# Altium schematic sheet Power.SchDoc: =DocumentName
size A4; Organization: Queen's Formula SAE; Address1: 130 Stuart St, Kingston; Address2: Ontario; Address3: Canada; Address4: K7L 2V9; DocumentNumber: 1; Revision: 0; SheetNumber: 1; SheetTotal: 1
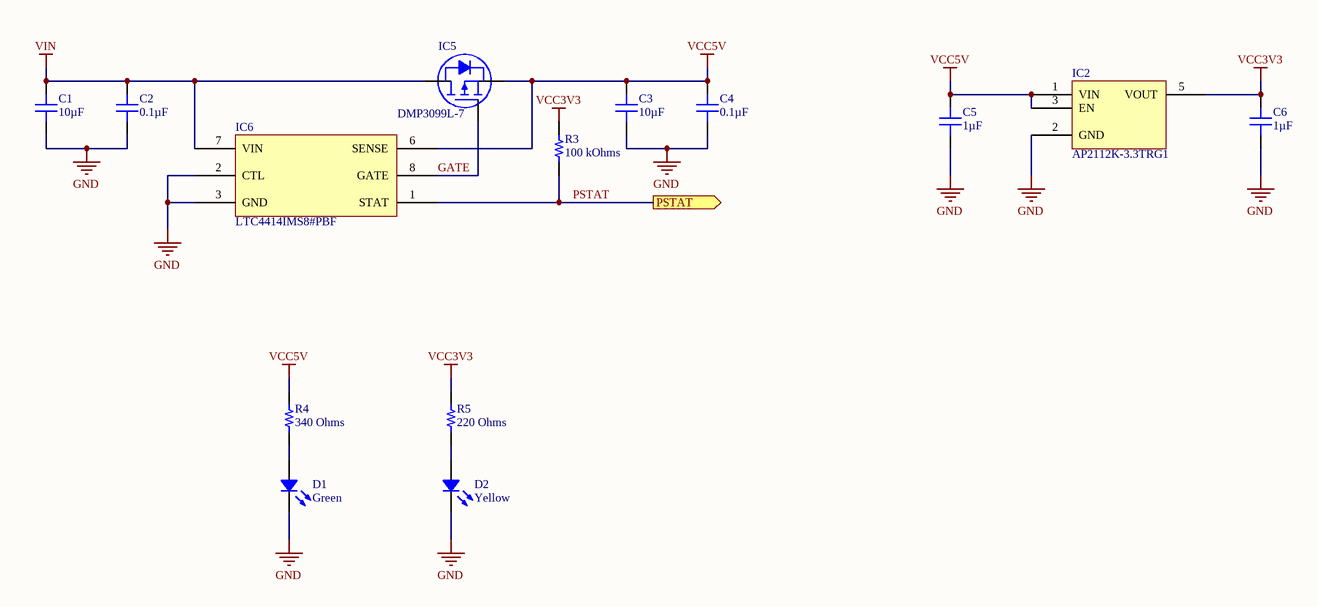
[diagram p0: Power.SchDoc]

## Parts
C1  10µF  [CAP 0402_1005]
C2  0.1µF  [CAP 0402_1005]
C3  10µF  [CAP 0402_1005]
C4  0.1µF  [CAP 0402_1005]
C5  1µF  [CAP 0402_1005]
C6  1µF  [CAP 0402_1005]
D1  Green  [LED 0402_1005 GREEN]
D2  Yellow  [LED 0402_1005 YELLOW]
IC2  AP2112K-3.3TRG1  [DIODES SOT-23-5 W5]
IC5  DMP3099L-7  [DIODES SOT-23-3]
IC6  LTC4414IMS8#PBF  [ANALOG MSOP-8 RM-8]
R3  100 kOhms  [RES 0201_0603]
R4  340 Ohms  [RES 0402_1005]
R5  220 Ohms  [RES 0402_1005]

## Ports
PSTAT (out)

## Nets
GND: C1.1 C2.1 C3.1 C4.1 C5.1 C6.1 D1.2 D2.2 IC2.2(GND) IC6.2(CTL) IC6.3(GND)
VCC3V3: C6.2 IC2.5(VOUT) R3.2 R5.2
VCC5V: C3.2 C4.2 C5.2 IC2.1(VIN) IC2.3(EN) IC5.2(S) IC6.6(SENSE) R4.2
VIN: C1.2 C2.2 IC5.3(D) IC6.7(VIN)
GATE: IC5.1(G) IC6.8(GATE)
PSTAT: IC6.1(STAT) R3.1 ; port PSTAT
NetD1_1: D1.1 R4.1
NetD2_1: D2.1 R5.1

## Notes on the sheet
- Title
- Size:
- Date:
- A4
- Number:
- Time:
- Revision:
- Sheet
- of
- File:

## Library data of the parts
C1 C3 = CL05A106MP8NUB8: CAP CER 10UF 10V X5R 0402; Manufacturer: Samsung Electro-Mechanics; Tolerance: ±20%; Part Number: CL05A106MP8NUB8; Value: 10µF; Applications: General Purpose; Capacitance: 10µF; ComponentLink1Description: Datasheet; ComponentLink1URL: http://www.samsungsem.com/kr/support/product-search/mlcc/CL05A106MP8NUB8.jsp; ComponentLink2Description: DigiKey Link; ComponentLink2URL: http://digikey.com/product-detail/en/samsung-electro-mechanics/CL05A106MP8NUB8/1276-6830-1-ND/5961689; Device Package: 0402 (1005 Metric); LastUpdated: 2020-09-02 1:02:25 AM; Lifecycle Status: Active; Minimum Order: 1; Mounting Type: Surface Mount, MLCC; Operating Temperature: -55°C ~ 85°C; Package / Case: 0402 (1005 Metric); Packaging: TapeAndReel; PartId: 1758; Part Status: Active; Price: 0.08; Series: CL; Size / Dimension: 0.039" L x 0.020" W (1.00mm x 0.50mm); Supplier 1: DigiKey; Supplier Part Number 1: 1276-6830-1-ND; Temperature Coefficient: X5R; Thickness (Max): 0.035" (0.90mm); Voltage - Rated: 10V
C2 C4 = C0402C104K4RECAUTO: CAP CER 0402 0.1UF 16V X7R 10%; Manufacturer: KEMET; Part Number: C0402C104K4RECAUTO; Value: 0.1µF; Applications: Automotive, ESD Protection; Capacitance: 0.1µF; ComponentLink1Description: Datasheet; ComponentLink1URL: https://api.kemet.com/component-edge/download/datasheet/C0402C104K4RECAUTO.pdf; ComponentLink2Description: DigiKey Link; ComponentLink2URL: http://digikey.com/product-detail/en/kemet/C0402C104K4RECAUTO/399-17167-1-ND/8563708; Device Package: 0402 (1005 Metric); LastUpdated: 2020-09-02 1:02:25 AM; Lifecycle Status: Active; Minimum Order: 1; Mounting Type: Surface Mount, MLCC; Operating Temperature: -55°C ~ 125°C; Package / Case: 0402 (1005 Metric); Packaging: TapeAndReel; PartId: 1731; Part Status: Active; Price: 0.02; Ratings: AEC-Q200; Series: ESD SMD Auto X7R; Size / Dimension: 0.039" L x 0.020" W (1.00mm x 0.50mm); Supplier 1: DigiKey; Supplier Part Number 1: 399-17167-1-ND; Temperature Coefficient: X7R; Thickness (Max): 0.022" (0.55mm); Tolerance: ±10%; Voltage - Rated: 16V
C5 C6 = 0402ZD105KAT4A: CAP CER 1UF 10V X5R 0402; Manufacturer: AVX Corporation; Tolerance: ±10%; Part Number: 0402ZD105KAT4A; Value: 1µF; Applications: General Purpose; Capacitance: 1µF; ComponentLink1Description: Datasheet; ComponentLink1URL: http://datasheets.avx.com/cx5r.pdf; ComponentLink2Description: DigiKey Link; ComponentLink2URL: http://digikey.com/product-detail/en/avx-corporation/0402ZD105KAT4A/478-10063-1-ND/6564285; Device Package: 0402 (1005 Metric); LastUpdated: 2020-09-02 1:02:25 AM; Lifecycle Status: Active; Minimum Order: 1; Mounting Type: Surface Mount, MLCC; Operating Temperature: -55°C ~ 85°C; Package / Case: 0402 (1005 Metric); Packaging: TapeAndReel; PartId: 1846; Part Status: Active; Price: 0.02; Series: -; Size / Dimension: 0.039" L x 0.020" W (1.00mm x 0.50mm); Supplier 1: DigiKey; Supplier Part Number 1: 478-10063-1-ND; Temperature Coefficient: X5R; Thickness (Max): 0.022" (0.56mm); Voltage - Rated: 10V
D1 = EAST10052GA0: LED GREEN CLEAR 2SMD; Manufacturer: Everlight Electronics Co Ltd; Configuration: Standard; Current - Test: 5mA; Lens Color: Colorless; Lens Size: 1.00mm x 0.50mm; Lens Style: Rectangle with Flat Top; Viewing Angle: 120°; Voltage - Forward (Vf) (Typ): 2.95V; Wavelength - Peak: 518nm; Part Number: EAST10052GA0; Color: Green; ComponentLink1Description: Datasheet; ComponentLink1URL: https://everlightamericas.com/index.php?controller=attachment&id_attachment=3256; ComponentLink2Description: DigiKey Link; ComponentLink2URL: http://digikey.com/product-detail/en/everlight-electronics-co-ltd/EAST10052GA0/1080-1557-1-ND/8510385; Device Package: 0402 (1005 Metric); Height (Max): 0.25mm; LastUpdated: 2020-09-02 1:20:38 AM; Lens Transparency: Clear; Lifecycle Status: Active; Minimum Order: 1; Mounting Type: Surface Mount; Package / Case: 0402 (1005 Metric); Packaging: TapeAndReel; PartId: 696; Part Status: Active; Price: 0.08; Series: -; Size / Dimension: 1.00mm L x 0.50mm W; Supplier 1: DigiKey; Supplier Part Number 1: 1080-1557-1-ND; Supplier Device Package: 2-SMD; Value: Green
D2 = APG1005SYC-T: LED YELLOW CLEAR CHIP SMD; Manufacturer: Kingbright; Configuration: Standard; Current - Test: 20mA; Lens Color: Colorless; Lens Size: 0.60mm x 0.50mm; Lens Style: Rectangle with Flat Top; Millicandela Rating: 100mcd; Viewing Angle: 120°; Voltage - Forward (Vf) (Typ): 2.05V; Wavelength - Dominant: 589nm; Wavelength - Peak: 591nm; Part Number: APG1005SYC-T; Color: Yellow; ComponentLink1Description: Datasheet; ComponentLink1URL: http://www.kingbrightusa.com/images/catalog/SPEC/APG1005SYC-T.pdf; ComponentLink2Description: DigiKey Link; ComponentLink2URL: http://digikey.com/product-detail/en/kingbright/APG1005SYC-T/754-1809-1-ND/4764945; Device Package: 0402 (1005 Metric); Height (Max): 0.25mm; LastUpdated: 2020-09-02 1:21:13 AM; Lens Transparency: Clear; Lifecycle Status: Active; Minimum Order: 1; Mounting Type: Surface Mount; Package / Case: 0402 (1005 Metric); Packaging: TapeAndReel; PartId: 173; Part Status: Active; Price: 0.10; Series: -; Size / Dimension: 1.00mm L x 0.50mm W; Supplier 1: DigiKey; Supplier Part Number 1: 754-1809-1-ND; Supplier Device Package: Chip LED; Value: Yellow
IC2 = AP2112K-3.3TRG1: IC REG LINEAR 3.3V 600MA SOT25; Manufacturer: Diodes Incorporated; Control Features: Enable; Current - Quiescent (Iq): 80µA; Number of Regulators: 1; Output Configuration: Positive; Output Type: Fixed; Protection Features: Over Current, Over Temperature; PSRR: 65sB (100Hz ~ 1KHz); Voltage Dropout (Max): 0.4V @ 600mA; Voltage - Input (Max): 6V; Part Number: AP2112K-3.3TRG1; ComponentLink1Description: Datasheet; ComponentLink1URL: https://www.diodes.com/assets/Datasheets/AP2112.pdf; ComponentLink2Description: DigiKey Link; ComponentLink2URL: http://digikey.com/product-detail/en/diodes-incorporated/AP2112K-3.3TRG1/AP2112K-3.3TRG1DICT-ND/4505257; Current - Output: 600mA; LastUpdated: 2020-09-02 1:25:56 AM; Lifecycle Status: Active; Minimum Order: 1; Mounting Type: Surface Mount; Operating Temperature: -40°C ~ 85°C; Package / Case: SC-74A, SOT-753; Packaging: TapeAndReel; Part Status: Active; Price: 0.10; Series: -; Supplier 1: DigiKey; Supplier Part Number 1: AP2112K-3.3TRG1DICT-ND; Supplier Device Package: SOT-25; Voltage - Output (Min/Fixed): 3.3V
IC5 = DMP3099L-7: MOSFET P-CH 30V SOT23; Manufacturer: Diodes Incorporated; Current - Continuous Drain (Id) @ 25°C: 3.8A (Ta); Drive Voltage (Max Rds On,  Min Rds On): 4.5V, 10V; FET Type: P-Channel; Gate Charge (Qg) (Max) @ Vgs: 5.2nC @ 4.5V; Input Capacitance (Ciss) (Max) @ Vds: 563pF @ 25V; Power Dissipation (Max): 1.08W (Ta); Rds On (Max) @ Id, Vgs: 65mOhm @ 3.8A, 10V; Vgs (Max): ±20V; Vgs(th) (Max) @ Id: 2.1V @ 250µA; Part Number: DMP3099L-7; ComponentLink1Description: Datasheet; ComponentLink1URL: https://www.diodes.com/assets/Datasheets/DMP3099L.pdf; ComponentLink2Description: DigiKey Link; ComponentLink2URL: http://digikey.com/product-detail/en/diodes-incorporated/DMP3099L-7/DMP3099L-7DICT-ND/5218217; Drain to Source Voltage (Vdss): 30V; LastUpdated: 2020-09-02 1:25:04 AM; Lifecycle Status: Active; Minimum Order: 1; Mounting Type: Surface Mount; Operating Temperature: -55°C ~ 150°C (TJ); Package / Case: TO-236-3, SC-59, SOT-23-3; Packaging: TapeAndReel; Part Status: Active; Price: 0.06; Series: -; Supplier 1: DigiKey; Supplier Part Number 1: DMP3099L-7DICT-ND; Supplier Device Package: SOT-23; Technology: MOSFET (Metal Oxide)
IC6 = LTC4414IMS8#PBF: IC OR CTRLR SRC SELECT 8MSOP; Manufacturer: Linear Technology/Analog Devices; Current - Supply: 31µA; Delay Time - OFF: 20µs; Delay Time - ON: 600µs; FET Type: P-Channel; Internal Switch(s): No; Ratio - Input:Output: 2:1; Voltage - Supply: 3V ~ 36V; Part Number: LTC4414IMS8#PBF; Applications: Battery Backup, Industrial/Automotive, High Current Switch; ComponentLink1Description: Datasheet; ComponentLink1URL: http://www.linear.com/docs/9037; ComponentLink2Description: DigiKey Link; ComponentLink2URL: http://digikey.com/product-detail/en/linear-technology-analog-devices/LTC4414IMS8-PBF/LTC4414IMS8-PBF-ND/1620227; Device Package: 8-TSSOP, 8-MSOP (0.118", 3.00mm Width); LastUpdated: 2020-02-02 11:30:38 AM; Lifecycle Status: Active; Minimum Order: 1; Mounting Type: Surface Mount; Operating Temperature: -40°C ~ 125°C; Package / Case: 8-TSSOP, 8-MSOP (0.118", 3.00mm Width); Packaging: Tube; Part Status: Active; Price: 4.97; Series: PowerPath™; Supplier 1: DigiKey; Supplier Part Number 1: LTC4414IMS8#PBF-ND; Supplier Device Package: 8-MSOP; Type: Source Selector Switch
R3 = CRG0201F100K: RES SMD 100K OHM 1% 1/20W 0201; Manufacturer: TE Connectivity Passive Product; Power (Watts): 0.05W, 1/20W; Temperature Coefficient: ±200ppm/°C; Part Number: CRG0201F100K; Value: 100 kOhms; ComponentLink1Description: Datasheet; ComponentLink1URL: https://www.te.com/commerce/DocumentDelivery/DDEController?Action=srchrtrv&DocNm=1773204&DocType=DS&DocLang=English; ComponentLink2Description: DigiKey Link; ComponentLink2URL: http://digikey.com/product-detail/en/te-connectivity-passive-product/CRG0201F100K/A129572CT-ND/8566776; Composition: Thick Film; Device Package: 0201 (0603 Metric); Height - Seated (Max): 0.010" (0.26mm); LastUpdated: 2020-09-02 1:06:26 AM; Lifecycle Status: Active; Minimum Order: 1; Number of Terminations: 2; Operating Temperature: -55°C ~ 155°C; Package / Case: 0201 (0603 Metric); Packaging: TapeAndReel; PartId: 2; Part Status: Active; Price: 0.02; Resistance: 100 kOhms; Series: CRG, Neohm; Size / Dimension: 0.024" L x 0.012" W (0.60mm x 0.30mm); Supplier 1: DigiKey; Supplier Part Number 1: A129572CT-ND; Supplier Device Package: 0201; Tolerance: ±1%
R4 = AC0402FR-07340RL: RES 340 OHM 1% 1/16W 0402; Manufacturer: Yageo; Power (Watts): 0.063W, 1/16W; Temperature Coefficient: ±100ppm/°C; Part Number: AC0402FR-07340RL; Value: 340 Ohms; ComponentLink1Description: Datasheet; ComponentLink1URL: https://www.yageo.com/upload/media/product/productsearch/datasheet/rchip/PYu-AC_51_RoHS_L_7.pdf; ComponentLink2Description: DigiKey Link; ComponentLink2URL: http://digikey.com/product-detail/en/yageo/AC0402FR-07340RL/YAG5147CT-ND/7063490; Composition: Thick Film; Device Package: 0402 (1005 Metric); Features: Automotive AEC-Q200, Moisture Resistant; Height - Seated (Max): 0.015" (0.37mm); LastUpdated: 2020-09-02 1:08:04 AM; Lifecycle Status: Active; Minimum Order: 1; Number of Terminations: 2; Operating Temperature: -55°C ~ 155°C; Package / Case: 0402 (1005 Metric); Packaging: CutTape; PartId: 5199; Part Status: Active; Price: 0.10; Ratings: AEC-Q200; Resistance: 340 Ohms; Series: AC; Size / Dimension: 0.039" L x 0.020" W (1.00mm x 0.50mm); Supplier 1: DigiKey; Supplier Part Number 1: YAG5147CT-ND; Supplier Device Package: 0402; Tolerance: ±1%
R5 = AC0402FR-07220RL: RES SMD 220 OHM 1% 1/16W 0402; Manufacturer: Yageo; Power (Watts): 0.063W, 1/16W; Temperature Coefficient: ±100ppm/°C; Part Number: AC0402FR-07220RL; Value: 220 Ohms; ComponentLink1Description: Datasheet; ComponentLink1URL: https://www.yageo.com/upload/media/product/productsearch/datasheet/rchip/PYu-AC_51_RoHS_L_7.pdf; ComponentLink2Description: DigiKey Link; ComponentLink2URL: http://digikey.com/product-detail/en/yageo/AC0402FR-07220RL/YAG3456CT-ND/6006305; Composition: Thick Film; Device Package: 0402 (1005 Metric); Features: Automotive AEC-Q200, Moisture Resistant; Height - Seated (Max): 0.015" (0.37mm); LastUpdated: 2020-09-02 1:07:50 AM; Lifecycle Status: Active; Minimum Order: 1; Number of Terminations: 2; Operating Temperature: -55°C ~ 155°C; Package / Case: 0402 (1005 Metric); Packaging: CutTape; PartId: 12084; Part Status: Active; Price: 0.10; Ratings: AEC-Q200; Resistance: 220 Ohms; Series: AC; Size / Dimension: 0.039" L x 0.020" W (1.00mm x 0.50mm); Supplier 1: DigiKey; Supplier Part Number 1: YAG3456CT-ND; Supplier Device Package: 0402; Tolerance: ±1%